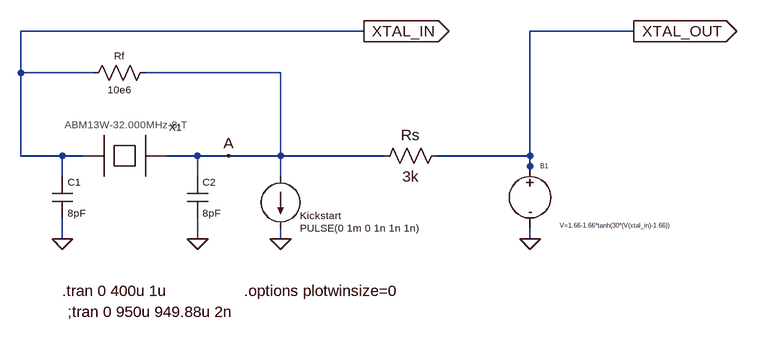
[diagram p0: schematic ABM13W-32.000MHz-8-T Testbench.asc]
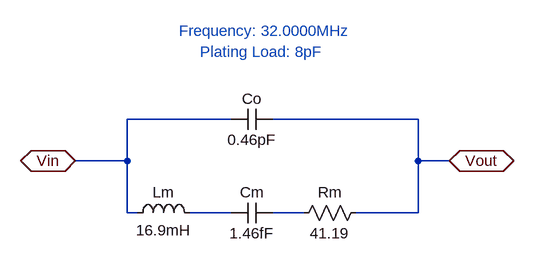
[diagram p1: sub-circuit abm13w-32.000mhz-8-t.asc]
ABM13W-32.000MHz-8-T Testbench.asc, the LTspice schematic file:
Version 4                                            
SHEET 1 1520 736                                     
WIRE 784 240 256 240                                 
WIRE 1200 240 1040 240                               
WIRE 256 304 256 240                                 
WIRE 368 304 256 304                                 
WIRE 656 304 448 304                                 
WIRE 256 432 256 304                                 
WIRE 320 432 256 432                                 
WIRE 352 432 320 432                                 
WIRE 528 432 480 432                                 
WIRE 576 432 528 432                                 
WIRE 656 432 656 304                                 
WIRE 656 432 576 432                                 
WIRE 816 432 656 432                                 
WIRE 1040 432 1040 240                               
WIRE 1040 432 896 432                                
WIRE 1040 448 1040 432                               
WIRE 320 464 320 432                                 
WIRE 528 464 528 432                                 
WIRE 656 464 656 432                                 
WIRE 1040 464 1040 448                               
WIRE 320 560 320 528                                 
WIRE 528 560 528 528                                 
WIRE 656 560 656 544                                 
WIRE 1040 560 1040 544                               
FLAG 320 560 0                                       
FLAG 528 560 0                                       
FLAG 656 560 0                                       
FLAG 1040 560 0                                      
FLAG 1200 240 XTAL_OUT                               
IOPIN 1200 240 Out                                   
FLAG 784 240 XTAL_IN                                 
IOPIN 784 240 Out                                    
FLAG 576 432 A                                       
SYMBOL cap 304 464 R0                                
WINDOW 0 24 8 Left 1                                 
WINDOW 3 24 56 Left 1                                
SYMATTR InstName C1                                  
SYMATTR Value 8pF                               
SYMBOL cap 512 464 R0                                
WINDOW 0 24 8 Left 1                                 
WINDOW 3 24 56 Left 1                                
SYMATTR InstName C2                                  
SYMATTR Value 8pF                               
SYMBOL current 656 464 R0                            
WINDOW 0 30 60 Left 1                                
WINDOW 3 30 79 Left 1                                
WINDOW 123 0 0 Left 0                                
WINDOW 39 0 0 Left 0                                 
SYMATTR InstName Kickstart                           
SYMATTR Value PULSE(0 1m 0 1n 1n 1n)                 
SYMBOL res 912 416 R90                               
WINDOW 0 0 56 VBottom 2                              
WINDOW 3 32 56 VTop 2                                
SYMATTR InstName Rs                                  
SYMATTR Value 3k                                     
SYMBOL res 464 288 R90                               
WINDOW 0 0 56 VBottom 1                              
WINDOW 3 32 56 VTop 1                                
SYMATTR InstName Rf                                  
SYMATTR Value 10e6                                   
SYMBOL ABM13W-32.000MHz-8-T 416 432 R0                         
SYMATTR InstName X1                                  
SYMBOL Inverting\ Amplifier 1040 496 R0             
SYMATTR Value V=1.66-1.66*tanh(30*(V(xtal_in)-1.66)) 
SYMATTR InstName B1                                  
TEXT 320 640 Left 2 !.tran 0 400u 1u                 
TEXT 600 640 Left 2 !.options plotwinsize=0          
TEXT 328 672 Left 2 !;tran 0 950u 949.88u 2n

abm13w-32.000mhz-8-t.asc, the sub-circuit schematic file:
Version 4
SHEET 1 880 680
WIRE 144 48 -16 48
WIRE 432 48 208 48
WIRE -16 112 -16 48
WIRE -16 112 -96 112
WIRE 432 112 432 48
WIRE 480 112 432 112
WIRE -16 192 -16 112
WIRE 0 192 -16 192
WIRE 144 192 80 192
WIRE 256 192 208 192
WIRE 432 192 432 112
WIRE 432 192 336 192
FLAG -96 112 Vin
IOPIN -96 112 BiDir
FLAG 480 112 Vout
IOPIN 480 112 BiDir
SYMBOL res 352 176 R90
WINDOW 0 0 56 VBottom 2
WINDOW 3 32 56 VTop 2
SYMATTR InstName Rm
SYMATTR Value 41.19
SYMBOL cap 208 176 R90
WINDOW 0 0 32 VBottom 2
WINDOW 3 32 32 VTop 2
SYMATTR InstName Cm
SYMATTR Value 1.46fF
SYMBOL cap 208 32 R90
WINDOW 0 0 32 VBottom 2
WINDOW 3 32 32 VTop 2
SYMATTR InstName Co
SYMATTR Value 0.46pF
SYMBOL ind -16 208 R270
WINDOW 0 32 56 VTop 2
WINDOW 3 5 56 VBottom 2
SYMATTR InstName Lm
SYMATTR Value 16.9mH
TEXT 96 -56 Left 2 ;Plating Load: 8pF
TEXT 64 -88 Left 2 ;Frequency: 32.0000MHz

The netlist it stands for:
* ABM13W-32.000MHz-8-T Testbench.asc
C1 XTAL_IN 0 8pF
C2 A 0 8pF
I§Kickstart A 0 PULSE(0 1m 0 1n 1n 1n)
Rs XTAL_OUT A 3k
Rf A XTAL_IN 10e6
XX1 A XTAL_IN abm13w-32.000mhz-8-t
B1 XTAL_OUT 0 V=1.66-1.66*tanh(30*(V(xtal_in)-1.66))

* block symbol definitions
.subckt abm13w-32.000mhz-8-t Vout Vin
Rm Vout N002 41.19
Cm N002 N001 1.46fF
Co Vout Vin 0.46pF
Lm Vin N001 16.9mH
* Plating Load: 8pF
* Frequency: 32.0000MHz
.ends abm13w-32.000mhz-8-t

.tran 0 400u 1u
.options plotwinsize=0
;tran 0 950u 949.88u 2n
.backanno
.end